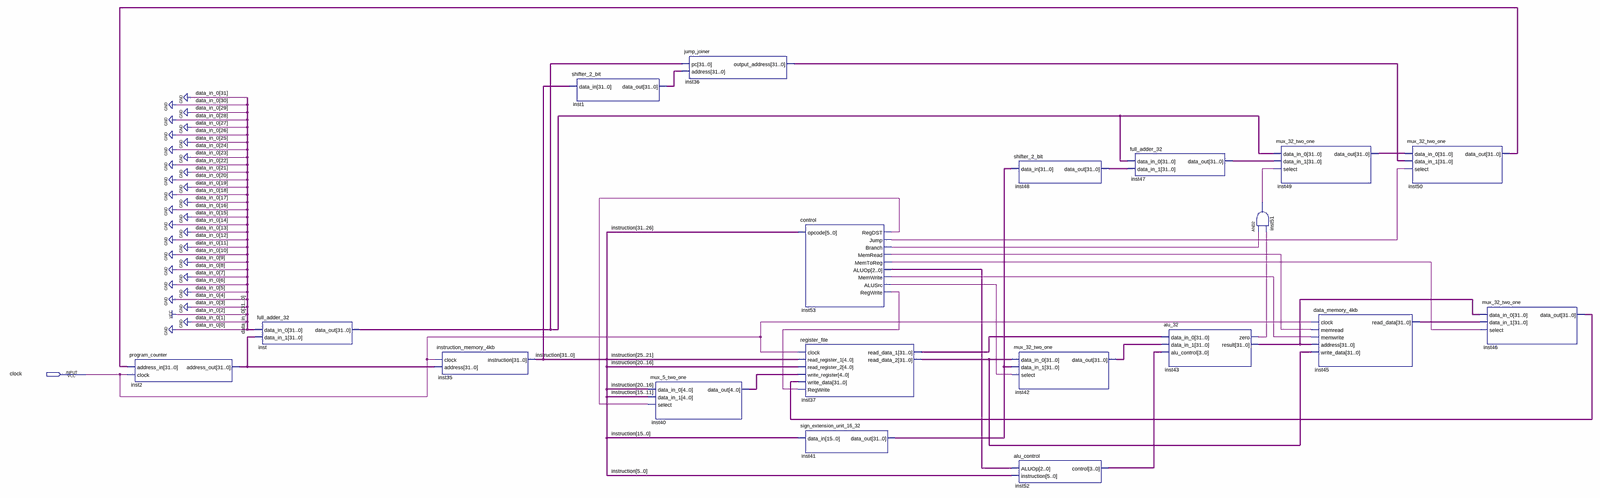
[diagram p0: schematic sheet, whole]
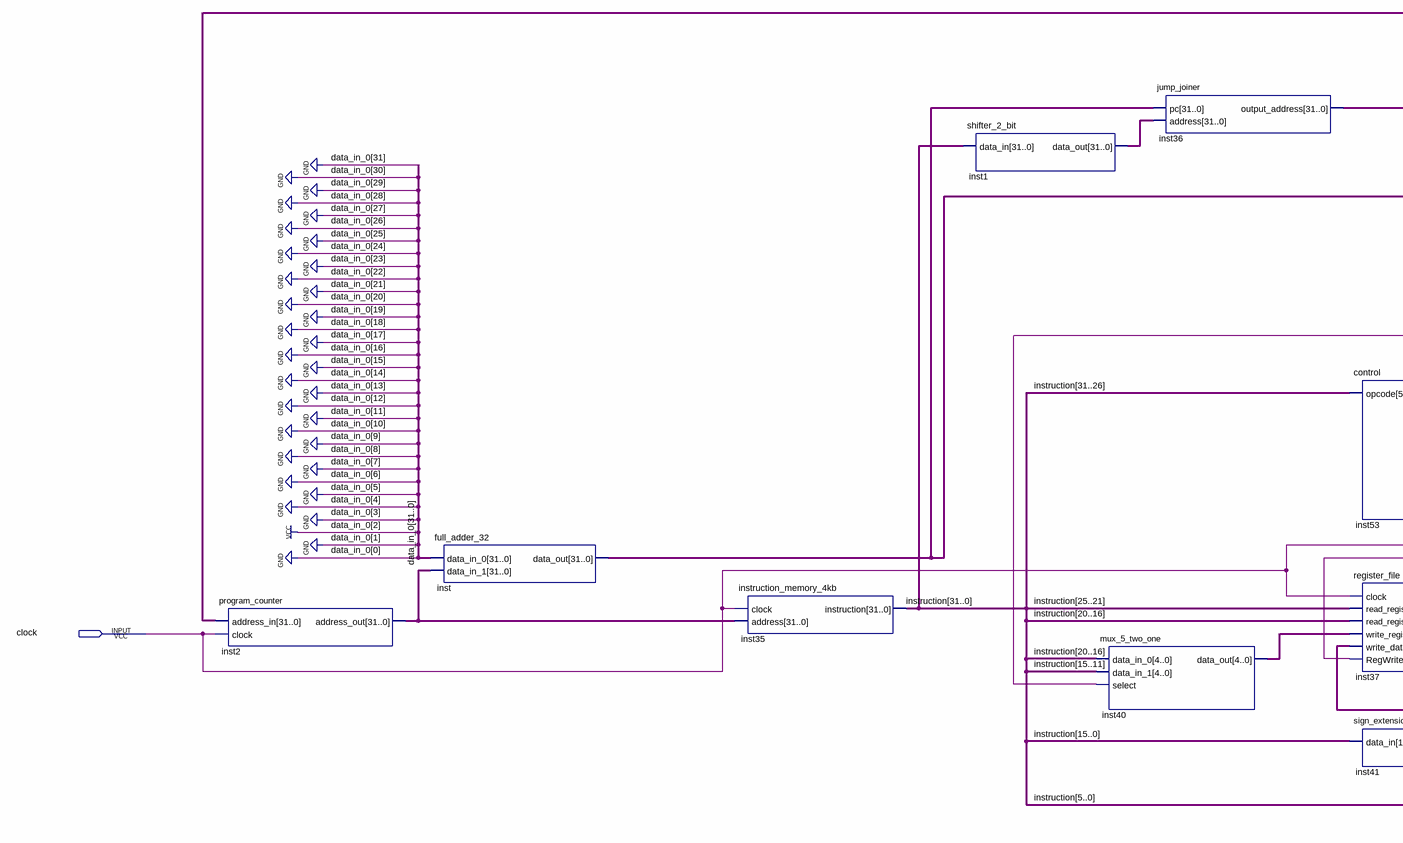
[diagram p1: schematic sheet, left part]
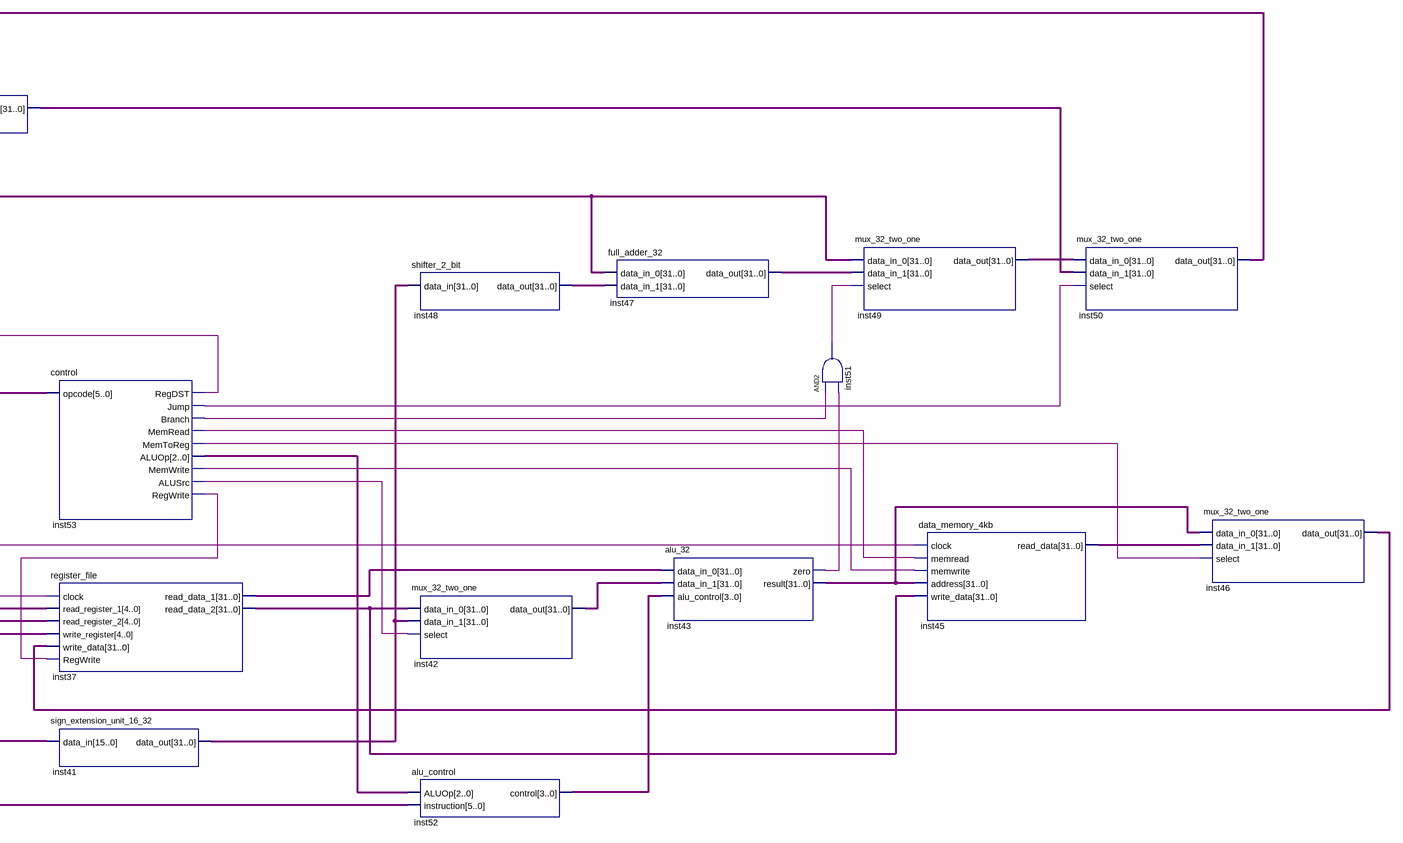
[diagram p2: schematic sheet, right part]
// Quartus schematic mips_32.bdf as structural Verilog: 19 symbols, 1 pins
module mips_32 (
  input  clock
);

  wire inst43_zero, inst51_out, inst53_alusrc, inst53_branch, inst53_jump, inst53_memread, inst53_memtoreg,
       inst53_memwrite, inst53_regdst, inst53_regwrite;
  wire [2:0] inst53_aluop;
  wire [3:0] inst52_control;
  wire [4:0] inst40_data_out;
  wire [31:0] inst1_data_out, inst2_address_out, inst36_output_address, inst37_read_data_1,
       inst37_read_data_2, inst41_data_out, inst42_data_out, inst43_result, inst45_read_data,
       inst46_data_out, inst47_data_out, inst48_data_out, inst49_data_out, inst50_data_out, inst_data_out,
       instruction;

  program_counter inst2 (.address_in(inst50_data_out), .clock(clock), .address_out(inst2_address_out));
  full_adder_32 inst (
    .data_in_0(32'b00000000000000000000000000000100), .data_in_1(inst2_address_out), .data_out(inst_data_out));
  instruction_memory_4kb inst35 (.clock(clock), .address(inst2_address_out), .instruction(instruction));
  shifter_2_bit inst1 (.data_in(instruction), .data_out(inst1_data_out));
  mux_5_two_one inst40 (
    .data_in_0(instruction[20:16]), .data_in_1(instruction[15:11]), .select(inst53_regdst),
    .data_out(inst40_data_out));
  jump_joiner inst36 (.pc(inst_data_out), .address(inst1_data_out), .output_address(inst36_output_address));
  control inst53 (
    .opcode(instruction[31:26]), .RegDST(inst53_regdst), .Jump(inst53_jump), .Branch(inst53_branch),
    .MemRead(inst53_memread), .MemToReg(inst53_memtoreg), .ALUOp(inst53_aluop), .MemWrite(inst53_memwrite),
    .ALUSrc(inst53_alusrc), .RegWrite(inst53_regwrite));
  register_file inst37 (
    .clock(clock), .read_register_1(instruction[25:21]), .read_register_2(instruction[20:16]),
    .write_register(inst40_data_out), .write_data(inst46_data_out), .RegWrite(inst53_regwrite),
    .read_data_1(inst37_read_data_1), .read_data_2(inst37_read_data_2));
  sign_extension_unit_16_32 inst41 (.data_in(instruction[15:0]), .data_out(inst41_data_out));
  shifter_2_bit inst48 (.data_in(inst41_data_out), .data_out(inst48_data_out));
  mux_32_two_one inst42 (
    .data_in_0(inst37_read_data_2), .data_in_1(inst41_data_out), .select(inst53_alusrc),
    .data_out(inst42_data_out));
  alu_control inst52 (.ALUOp(inst53_aluop), .instruction(instruction[5:0]), .control(inst52_control));
  full_adder_32 inst47 (.data_in_0(inst_data_out), .data_in_1(inst48_data_out), .data_out(inst47_data_out));
  alu_32 inst43 (
    .data_in_0(inst37_read_data_1), .data_in_1(inst42_data_out), .alu_control(inst52_control),
    .zero(inst43_zero), .result(inst43_result));
  mux_32_two_one inst49 (
    .data_in_0(inst_data_out), .data_in_1(inst47_data_out), .select(inst51_out), .data_out(inst49_data_out));
  and inst51 (inst51_out, inst53_branch, inst43_zero);
  data_memory_4kb inst45 (
    .clock(clock), .memread(inst53_memread), .memwrite(inst53_memwrite), .address(inst43_result),
    .write_data(inst37_read_data_2), .read_data(inst45_read_data));
  mux_32_two_one inst50 (
    .data_in_0(inst49_data_out), .data_in_1(inst36_output_address), .select(inst53_jump),
    .data_out(inst50_data_out));
  mux_32_two_one inst46 (
    .data_in_0(inst43_result), .data_in_1(inst45_read_data), .select(inst53_memtoreg),
    .data_out(inst46_data_out));
endmodule
